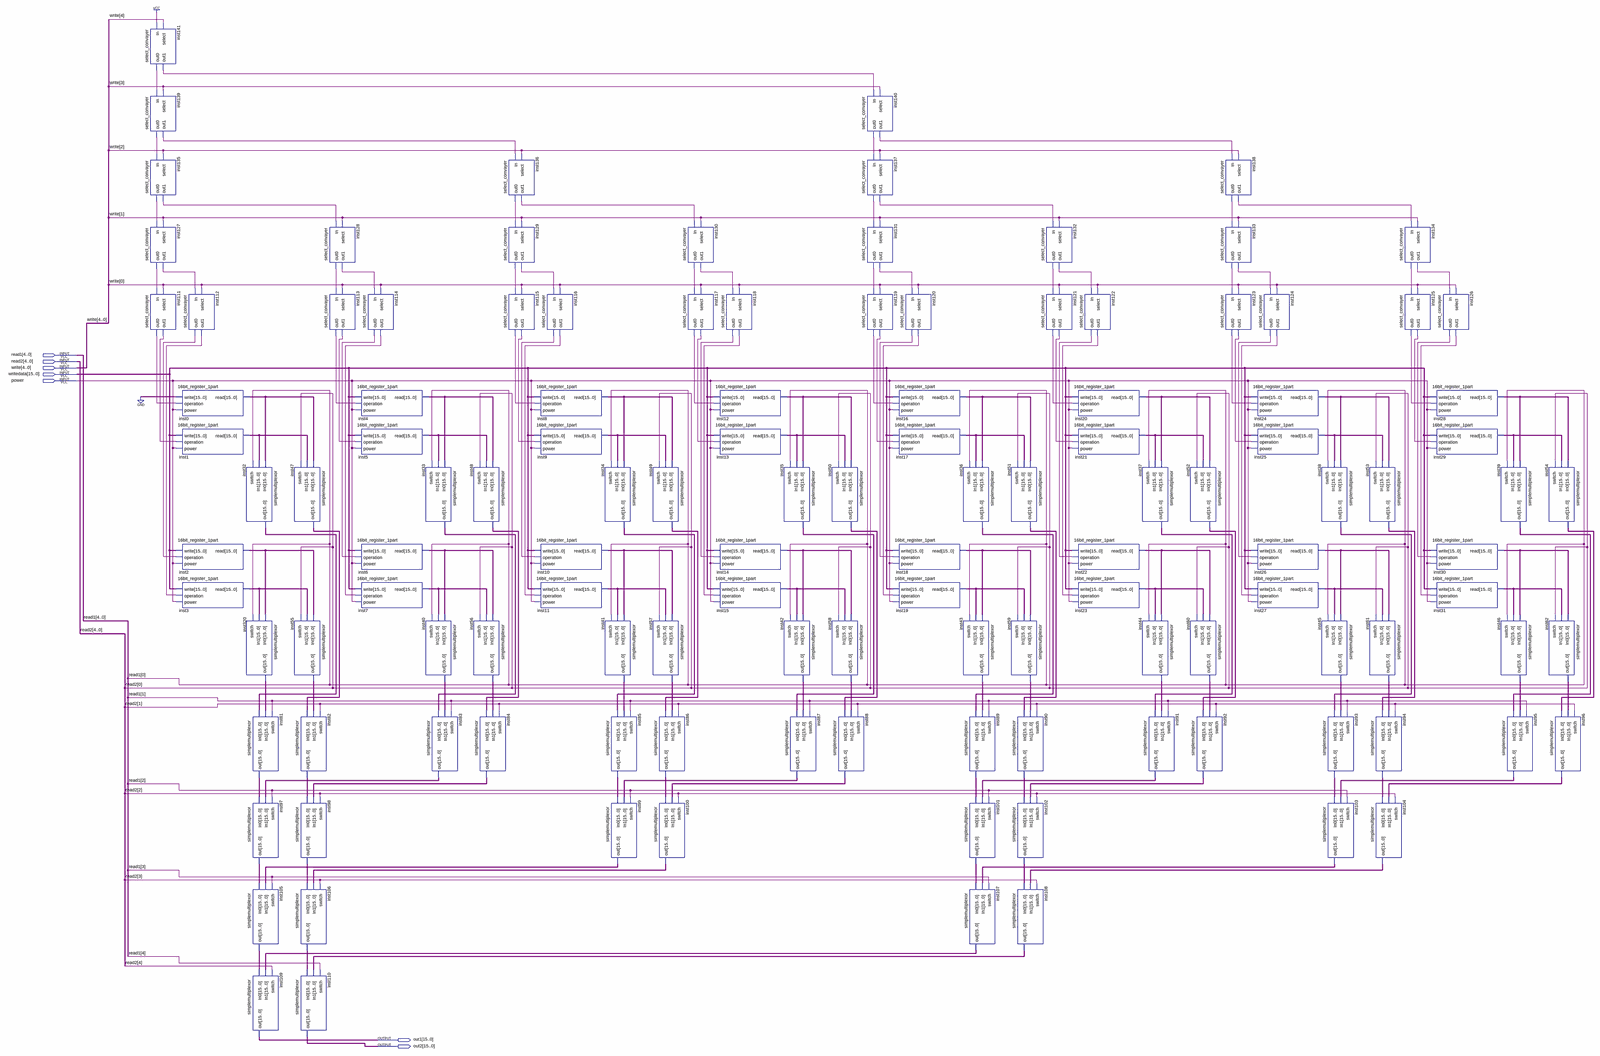
[diagram p0: schematic sheet, whole]
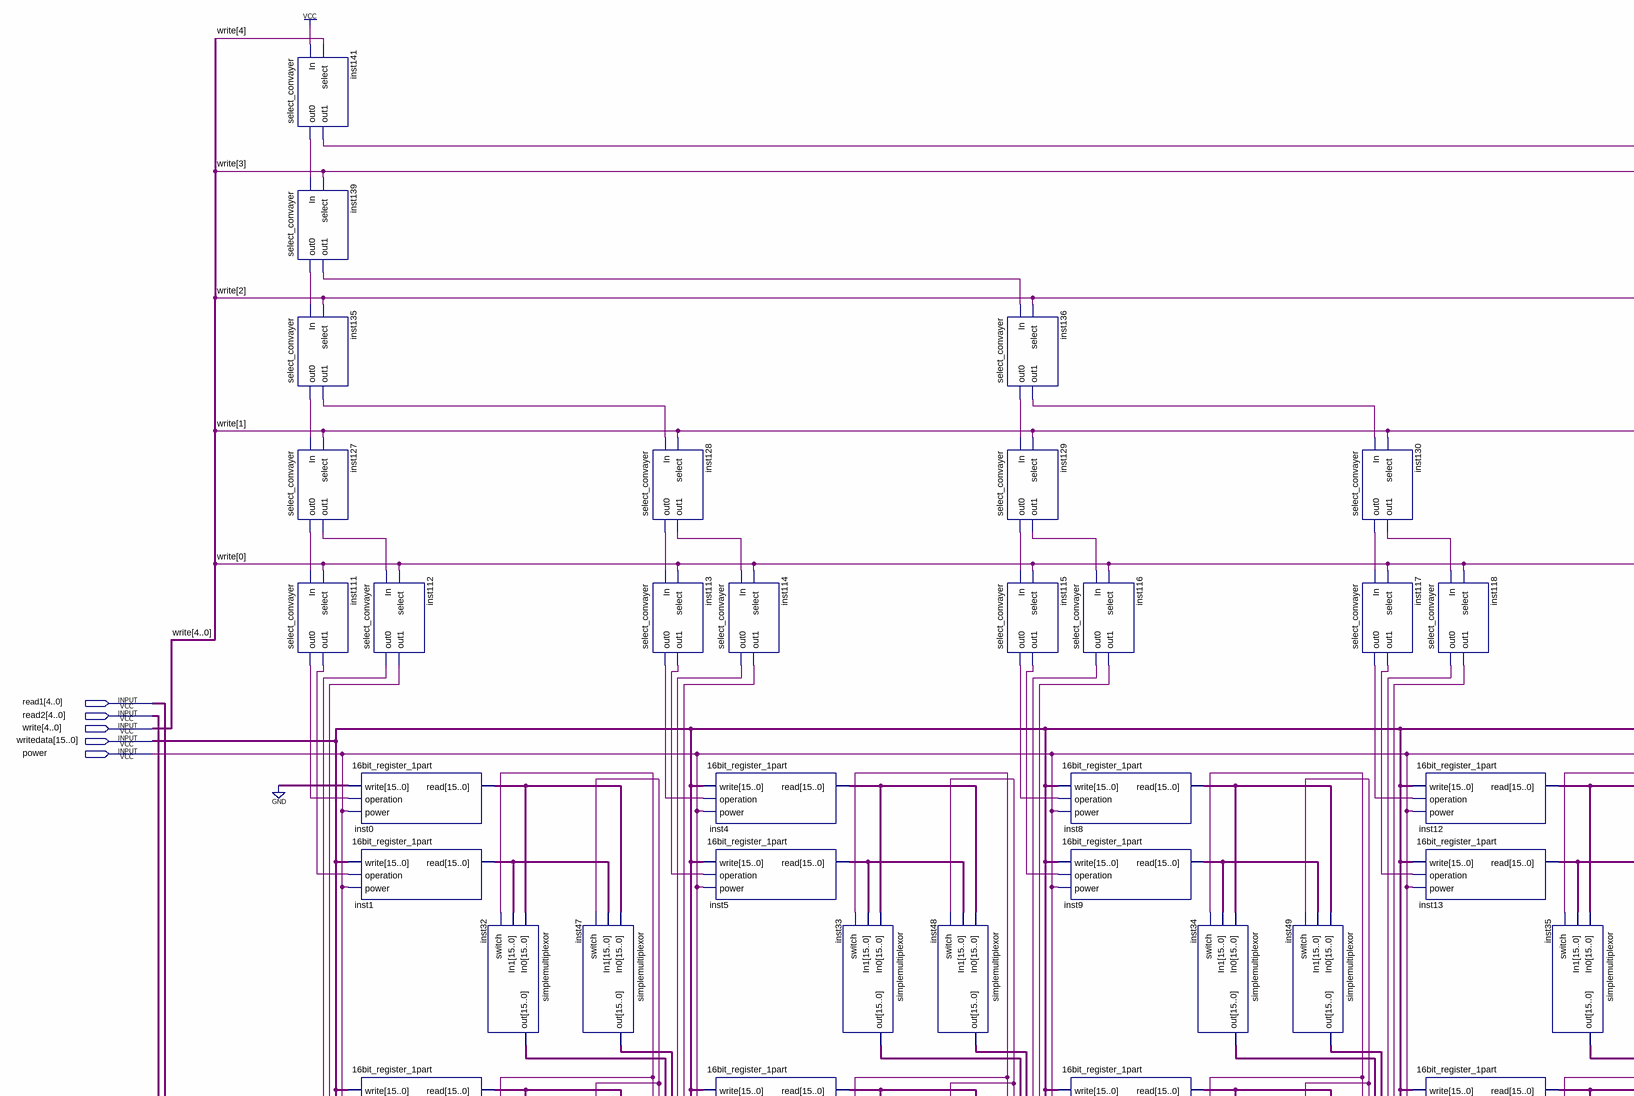
[diagram p1: schematic sheet, upper left part]
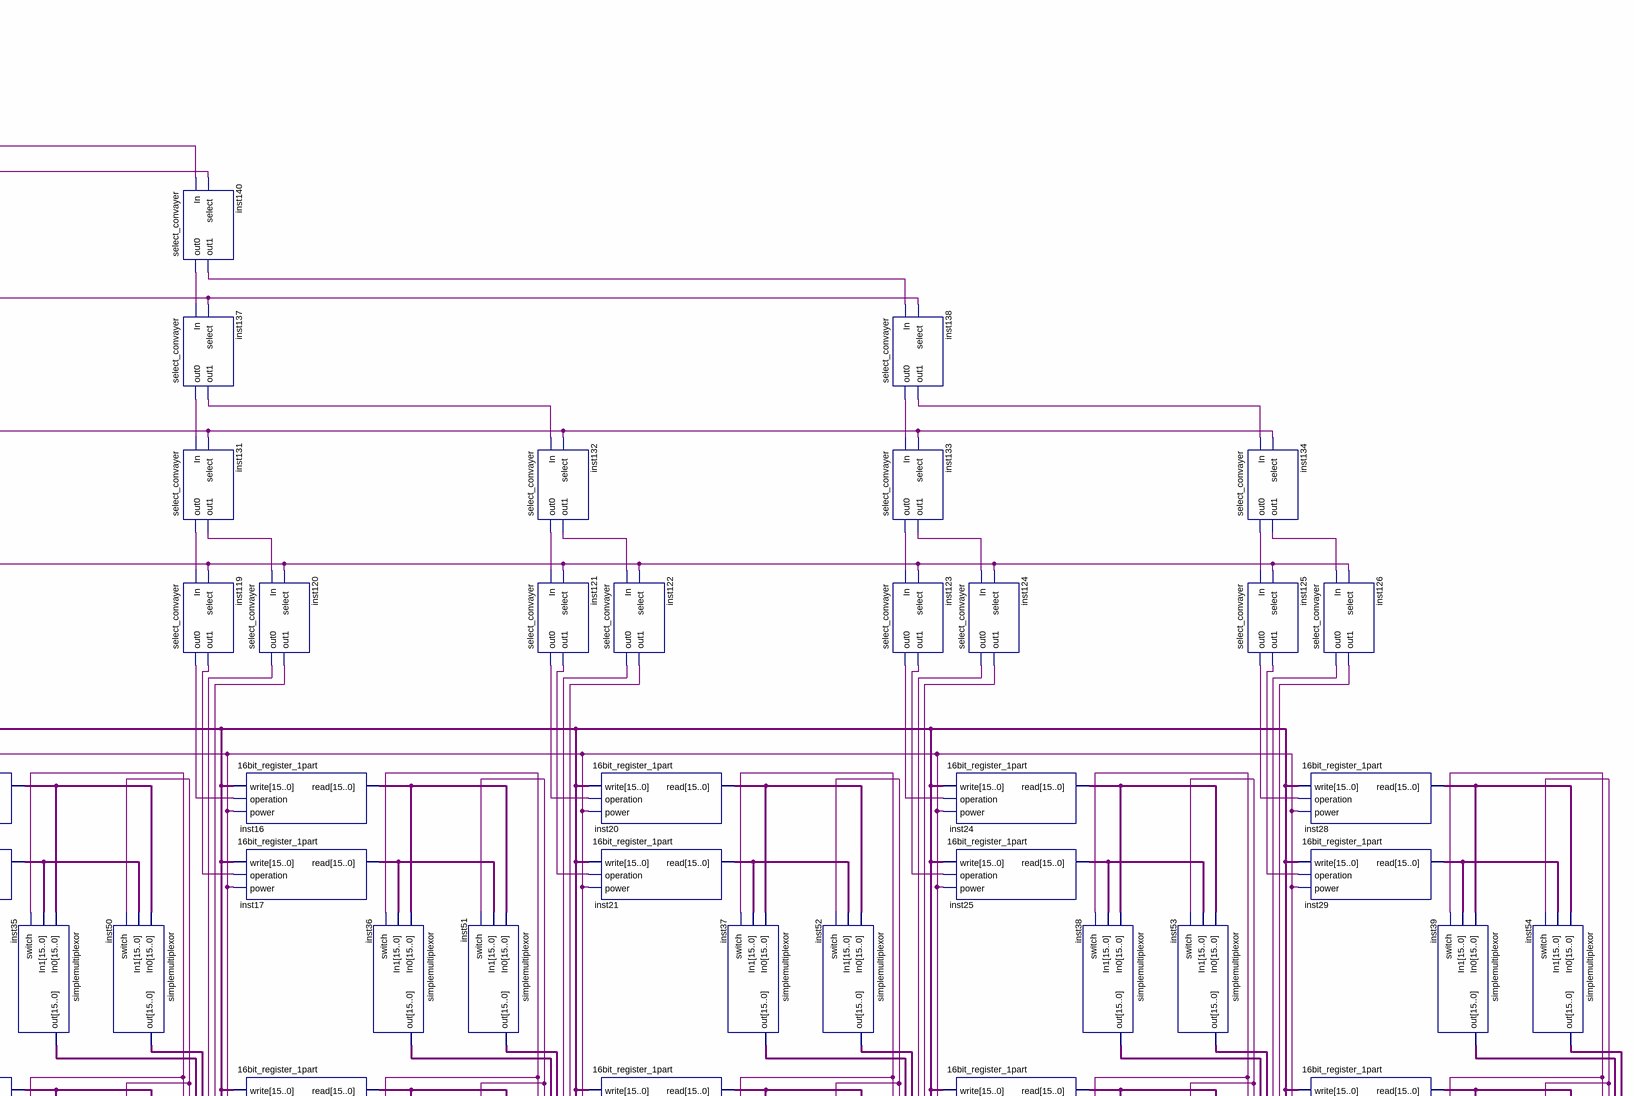
[diagram p2: schematic sheet, upper right part]
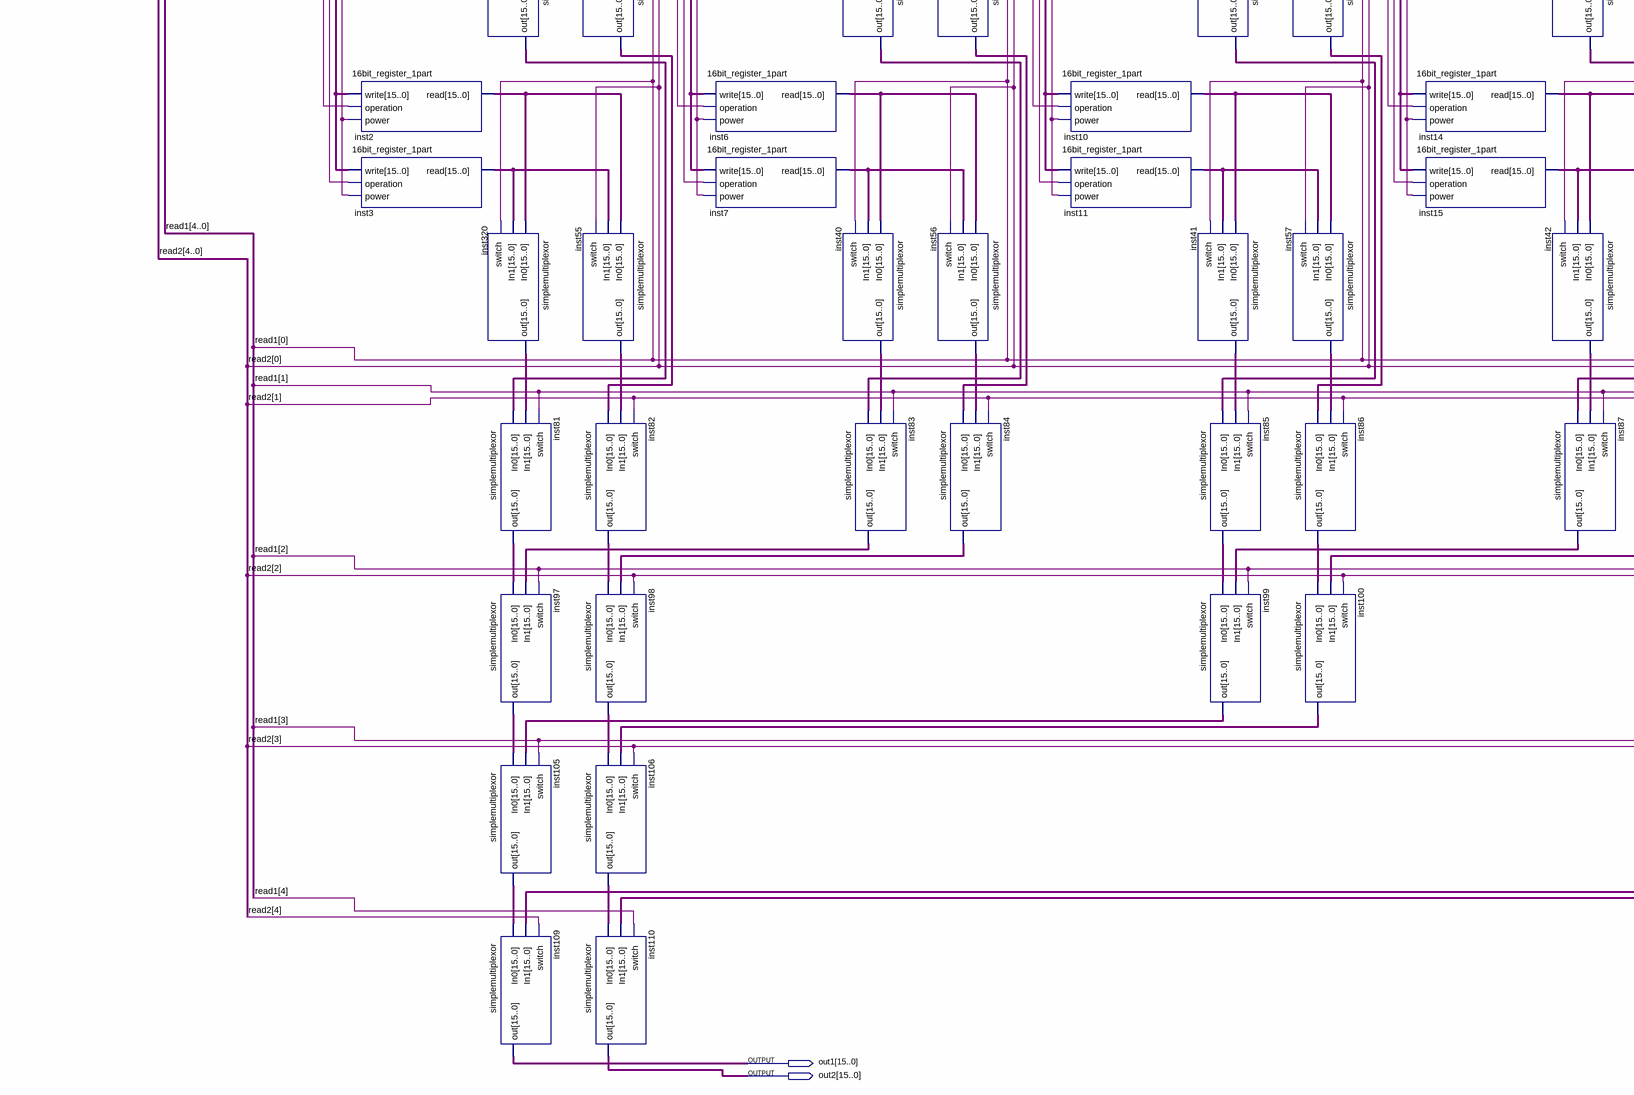
[diagram p3: schematic sheet, lower left part]
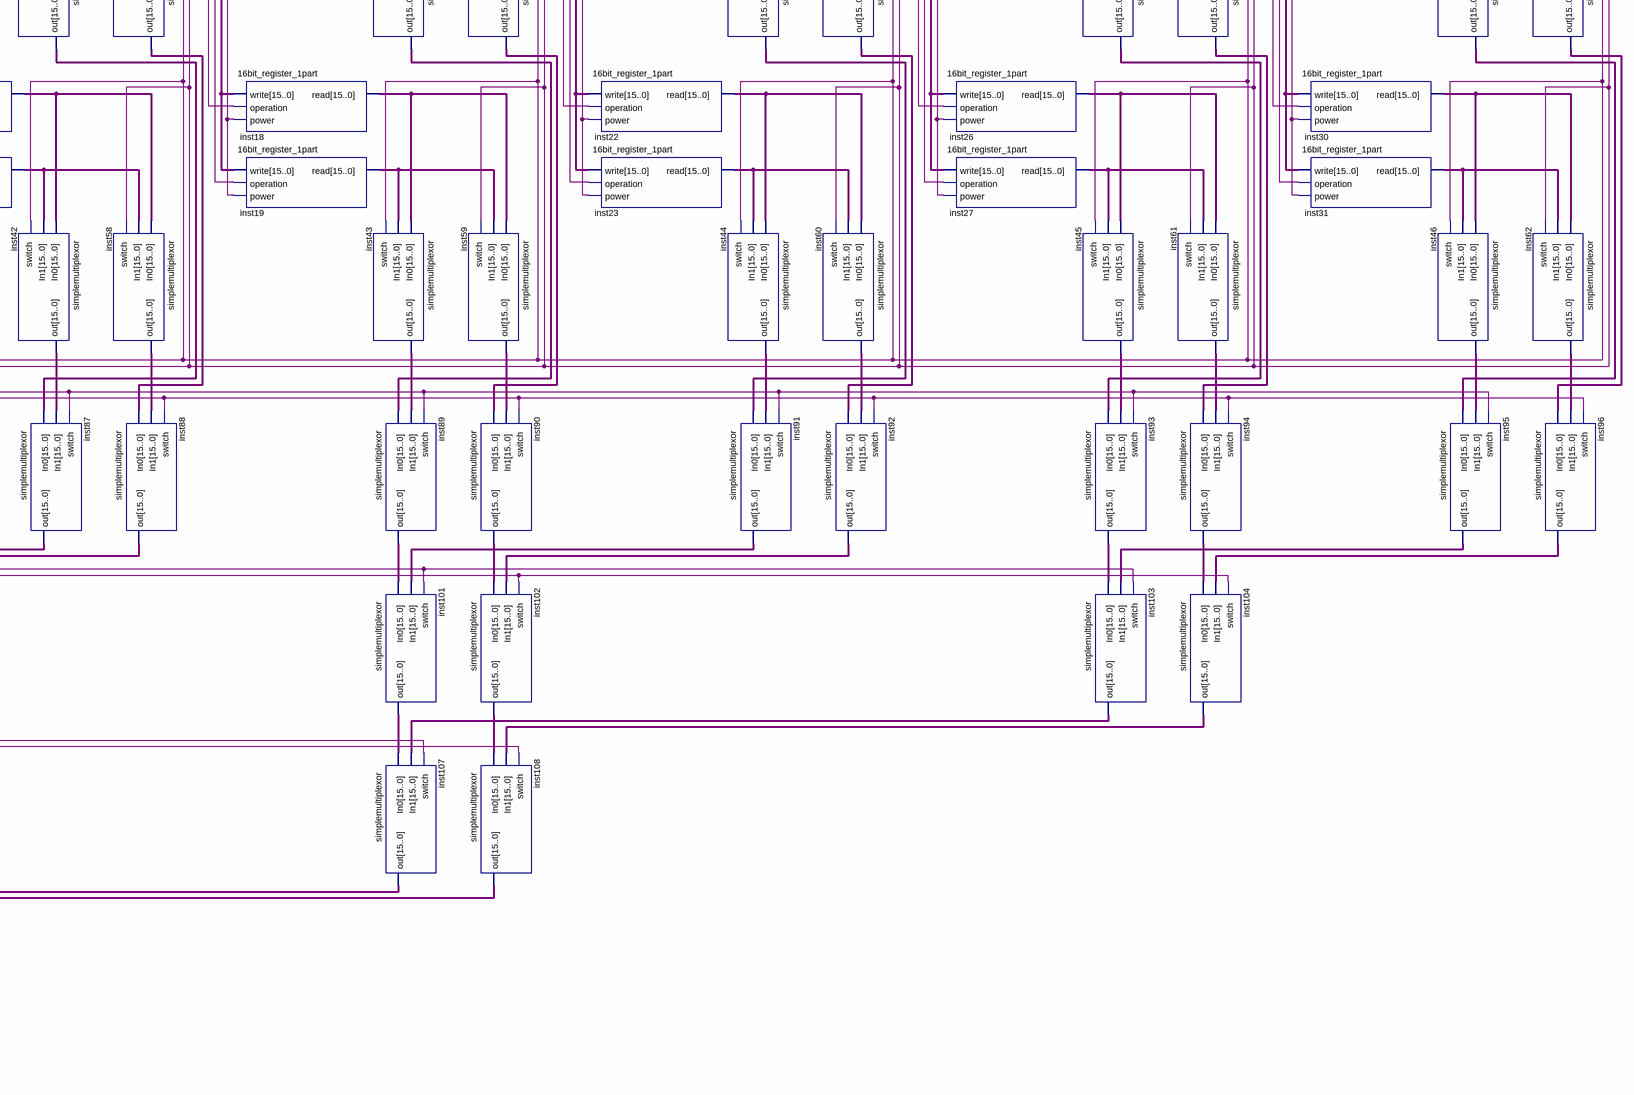
[diagram p4: schematic sheet, lower right part]
// Quartus schematic register.bdf as structural Verilog: 125 symbols, 7 pins
module register (
  input  [4:0] read1,
  input  [4:0] read2,
  input  [4:0] write,
  input  [15:0] writedata,
  input  power,
  output [15:0] out1,
  output [15:0] out2
);

  wire inst111_out0, inst111_out1, inst112_out0, inst112_out1, inst113_out0, inst113_out1, inst114_out0,
       inst114_out1, inst115_out0, inst115_out1, inst116_out0, inst116_out1, inst117_out0, inst117_out1,
       inst118_out0, inst118_out1, inst119_out0, inst119_out1, inst120_out0, inst120_out1, inst121_out0,
       inst121_out1, inst122_out0, inst122_out1, inst123_out0, inst123_out1, inst124_out0, inst124_out1,
       inst125_out0, inst125_out1, inst126_out0, inst126_out1, inst127_out0, inst127_out1, inst128_out0,
       inst128_out1, inst129_out0, inst129_out1, inst130_out0, inst130_out1, inst131_out0, inst131_out1,
       inst132_out0, inst132_out1, inst133_out0, inst133_out1, inst134_out0, inst134_out1, inst135_out0,
       inst135_out1, inst136_out0, inst136_out1, inst137_out0, inst137_out1, inst138_out0, inst138_out1,
       inst139_out0, inst139_out1, inst140_out0, inst140_out1, inst141_out0, inst141_out1;
  wire [15:0] inst0_read, inst1_read, inst2_read, inst3_read, inst4_read, inst5_read, inst6_read, inst7_read,
       inst8_read, inst9_read, inst10_read, inst11_read, inst12_read, inst13_read, inst14_read, inst15_read,
       inst16_read, inst17_read, inst18_read, inst19_read, inst20_read, inst21_read, inst22_read,
       inst23_read, inst24_read, inst25_read, inst26_read, inst27_read, inst28_read, inst29_read,
       inst30_read, inst31_read, inst32_out, inst33_out, inst34_out, inst35_out, inst36_out, inst37_out,
       inst38_out, inst39_out, inst40_out, inst41_out, inst42_out, inst43_out, inst44_out, inst45_out,
       inst46_out, inst47_out, inst48_out, inst49_out, inst50_out, inst51_out, inst52_out, inst53_out,
       inst54_out, inst55_out, inst56_out, inst57_out, inst58_out, inst59_out, inst60_out, inst61_out,
       inst62_out, inst81_out, inst82_out, inst83_out, inst84_out, inst85_out, inst86_out, inst87_out,
       inst88_out, inst89_out, inst90_out, inst91_out, inst92_out, inst93_out, inst94_out, inst95_out,
       inst96_out, inst97_out, inst98_out, inst99_out, inst100_out, inst101_out, inst102_out, inst103_out,
       inst104_out, inst105_out, inst106_out, inst107_out, inst108_out, inst320_out;

  select_convayer inst141 (.In(1'b1), .select(write[4]), .out0(inst141_out0), .out1(inst141_out1));
  select_convayer inst139 (.In(inst141_out0), .select(write[3]), .out0(inst139_out0), .out1(inst139_out1));
  select_convayer inst135 (.In(inst139_out0), .select(write[2]), .out0(inst135_out0), .out1(inst135_out1));
  select_convayer inst127 (.In(inst135_out0), .select(write[1]), .out0(inst127_out0), .out1(inst127_out1));
  select_convayer inst111 (.In(inst127_out0), .select(write[0]), .out0(inst111_out0), .out1(inst111_out1));
  \16bit_register_1part  inst0 (.write({16{1'b0}}), .operation(inst111_out0), .power(power), .read(inst0_read));
  \16bit_register_1part  inst1 (.write(writedata), .operation(inst111_out1), .power(power), .read(inst1_read));
  \16bit_register_1part  inst2 (.write(writedata), .operation(inst112_out0), .power(power), .read(inst2_read));
  \16bit_register_1part  inst3 (.write(writedata), .operation(inst112_out1), .power(power), .read(inst3_read));
  select_convayer inst112 (.In(inst127_out1), .select(write[0]), .out0(inst112_out0), .out1(inst112_out1));
  simplemultiplexor inst32 (.In0(inst0_read), .In1(inst1_read), .switch(read1[0]), .out(inst32_out));
  simplemultiplexor inst320 (.In0(inst2_read), .In1(inst3_read), .switch(read1[0]), .out(inst320_out));
  simplemultiplexor inst81 (.In0(inst32_out), .In1(inst320_out), .switch(read1[1]), .out(inst81_out));
  simplemultiplexor inst97 (.In0(inst81_out), .In1(inst83_out), .switch(read1[2]), .out(inst97_out));
  simplemultiplexor inst105 (.In0(inst97_out), .In1(inst99_out), .switch(read1[3]), .out(inst105_out));
  simplemultiplexor inst109 (.In0(inst105_out), .In1(inst107_out), .switch(read2[4]), .out(out1));
  simplemultiplexor inst47 (.In0(inst0_read), .In1(inst1_read), .switch(read2[0]), .out(inst47_out));
  simplemultiplexor inst55 (.In0(inst2_read), .In1(inst3_read), .switch(read2[0]), .out(inst55_out));
  simplemultiplexor inst82 (.In0(inst47_out), .In1(inst55_out), .switch(read2[1]), .out(inst82_out));
  simplemultiplexor inst98 (.In0(inst82_out), .In1(inst84_out), .switch(read2[2]), .out(inst98_out));
  simplemultiplexor inst106 (.In0(inst98_out), .In1(inst100_out), .switch(read2[3]), .out(inst106_out));
  simplemultiplexor inst110 (.In0(inst106_out), .In1(inst108_out), .switch(read1[4]), .out(out2));
  select_convayer inst128 (.In(inst135_out1), .select(write[1]), .out0(inst128_out0), .out1(inst128_out1));
  select_convayer inst113 (.In(inst128_out0), .select(write[0]), .out0(inst113_out0), .out1(inst113_out1));
  \16bit_register_1part  inst4 (.write(writedata), .operation(inst113_out0), .power(power), .read(inst4_read));
  \16bit_register_1part  inst5 (.write(writedata), .operation(inst113_out1), .power(power), .read(inst5_read));
  \16bit_register_1part  inst6 (.write(writedata), .operation(inst114_out0), .power(power), .read(inst6_read));
  \16bit_register_1part  inst7 (.write(writedata), .operation(inst114_out1), .power(power), .read(inst7_read));
  select_convayer inst114 (.In(inst128_out1), .select(write[0]), .out0(inst114_out0), .out1(inst114_out1));
  simplemultiplexor inst33 (.In0(inst4_read), .In1(inst5_read), .switch(read1[0]), .out(inst33_out));
  simplemultiplexor inst40 (.In0(inst6_read), .In1(inst7_read), .switch(read1[0]), .out(inst40_out));
  simplemultiplexor inst83 (.In0(inst33_out), .In1(inst40_out), .switch(read1[1]), .out(inst83_out));
  simplemultiplexor inst48 (.In0(inst4_read), .In1(inst5_read), .switch(read2[0]), .out(inst48_out));
  simplemultiplexor inst56 (.In0(inst6_read), .In1(inst7_read), .switch(read2[0]), .out(inst56_out));
  simplemultiplexor inst84 (.In0(inst48_out), .In1(inst56_out), .switch(read2[1]), .out(inst84_out));
  select_convayer inst136 (.In(inst139_out1), .select(write[2]), .out0(inst136_out0), .out1(inst136_out1));
  select_convayer inst129 (.In(inst136_out0), .select(write[1]), .out0(inst129_out0), .out1(inst129_out1));
  select_convayer inst115 (.In(inst129_out0), .select(write[0]), .out0(inst115_out0), .out1(inst115_out1));
  \16bit_register_1part  inst8 (.write(writedata), .operation(inst115_out0), .power(power), .read(inst8_read));
  \16bit_register_1part  inst9 (.write(writedata), .operation(inst115_out1), .power(power), .read(inst9_read));
  \16bit_register_1part  inst10 (.write(writedata), .operation(inst116_out0), .power(power), .read(inst10_read));
  \16bit_register_1part  inst11 (.write(writedata), .operation(inst116_out1), .power(power), .read(inst11_read));
  select_convayer inst116 (.In(inst129_out1), .select(write[0]), .out0(inst116_out0), .out1(inst116_out1));
  simplemultiplexor inst34 (.In0(inst8_read), .In1(inst9_read), .switch(read1[0]), .out(inst34_out));
  simplemultiplexor inst41 (.In0(inst10_read), .In1(inst11_read), .switch(read1[0]), .out(inst41_out));
  simplemultiplexor inst85 (.In0(inst34_out), .In1(inst41_out), .switch(read1[1]), .out(inst85_out));
  simplemultiplexor inst99 (.In0(inst85_out), .In1(inst87_out), .switch(read1[2]), .out(inst99_out));
  simplemultiplexor inst49 (.In0(inst8_read), .In1(inst9_read), .switch(read2[0]), .out(inst49_out));
  simplemultiplexor inst57 (.In0(inst10_read), .In1(inst11_read), .switch(read2[0]), .out(inst57_out));
  simplemultiplexor inst86 (.In0(inst49_out), .In1(inst57_out), .switch(read2[1]), .out(inst86_out));
  simplemultiplexor inst100 (.In0(inst86_out), .In1(inst88_out), .switch(read2[2]), .out(inst100_out));
  select_convayer inst130 (.In(inst136_out1), .select(write[1]), .out0(inst130_out0), .out1(inst130_out1));
  select_convayer inst117 (.In(inst130_out0), .select(write[0]), .out0(inst117_out0), .out1(inst117_out1));
  \16bit_register_1part  inst12 (.write(writedata), .operation(inst117_out0), .power(power), .read(inst12_read));
  \16bit_register_1part  inst13 (.write(writedata), .operation(inst117_out1), .power(power), .read(inst13_read));
  \16bit_register_1part  inst14 (.write(writedata), .operation(inst118_out0), .power(power), .read(inst14_read));
  \16bit_register_1part  inst15 (.write(writedata), .operation(inst118_out1), .power(power), .read(inst15_read));
  select_convayer inst118 (.In(inst130_out1), .select(write[0]), .out0(inst118_out0), .out1(inst118_out1));
  simplemultiplexor inst35 (.In0(inst12_read), .In1(inst13_read), .switch(read1[0]), .out(inst35_out));
  simplemultiplexor inst42 (.In0(inst14_read), .In1(inst15_read), .switch(read1[0]), .out(inst42_out));
  simplemultiplexor inst87 (.In0(inst35_out), .In1(inst42_out), .switch(read1[1]), .out(inst87_out));
  simplemultiplexor inst50 (.In0(inst12_read), .In1(inst13_read), .switch(read2[0]), .out(inst50_out));
  simplemultiplexor inst58 (.In0(inst14_read), .In1(inst15_read), .switch(read2[0]), .out(inst58_out));
  simplemultiplexor inst88 (.In0(inst50_out), .In1(inst58_out), .switch(read2[1]), .out(inst88_out));
  select_convayer inst140 (.In(inst141_out1), .select(write[3]), .out0(inst140_out0), .out1(inst140_out1));
  select_convayer inst137 (.In(inst140_out0), .select(write[2]), .out0(inst137_out0), .out1(inst137_out1));
  select_convayer inst131 (.In(inst137_out0), .select(write[1]), .out0(inst131_out0), .out1(inst131_out1));
  select_convayer inst119 (.In(inst131_out0), .select(write[0]), .out0(inst119_out0), .out1(inst119_out1));
  \16bit_register_1part  inst16 (.write(writedata), .operation(inst119_out0), .power(power), .read(inst16_read));
  \16bit_register_1part  inst17 (.write(writedata), .operation(inst119_out1), .power(power), .read(inst17_read));
  \16bit_register_1part  inst18 (.write(writedata), .operation(inst120_out0), .power(power), .read(inst18_read));
  \16bit_register_1part  inst19 (.write(writedata), .operation(inst120_out1), .power(power), .read(inst19_read));
  select_convayer inst120 (.In(inst131_out1), .select(write[0]), .out0(inst120_out0), .out1(inst120_out1));
  simplemultiplexor inst36 (.In0(inst16_read), .In1(inst17_read), .switch(read1[0]), .out(inst36_out));
  simplemultiplexor inst43 (.In0(inst18_read), .In1(inst19_read), .switch(read1[0]), .out(inst43_out));
  simplemultiplexor inst89 (.In0(inst36_out), .In1(inst43_out), .switch(read1[1]), .out(inst89_out));
  simplemultiplexor inst101 (.In0(inst89_out), .In1(inst91_out), .switch(read1[2]), .out(inst101_out));
  simplemultiplexor inst107 (.In0(inst101_out), .In1(inst103_out), .switch(read1[3]), .out(inst107_out));
  simplemultiplexor inst51 (.In0(inst16_read), .In1(inst17_read), .switch(read2[0]), .out(inst51_out));
  simplemultiplexor inst59 (.In0(inst18_read), .In1(inst19_read), .switch(read2[0]), .out(inst59_out));
  simplemultiplexor inst90 (.In0(inst51_out), .In1(inst59_out), .switch(read2[1]), .out(inst90_out));
  simplemultiplexor inst102 (.In0(inst90_out), .In1(inst92_out), .switch(read2[2]), .out(inst102_out));
  simplemultiplexor inst108 (.In0(inst102_out), .In1(inst104_out), .switch(read2[3]), .out(inst108_out));
  select_convayer inst132 (.In(inst137_out1), .select(write[1]), .out0(inst132_out0), .out1(inst132_out1));
  select_convayer inst121 (.In(inst132_out0), .select(write[0]), .out0(inst121_out0), .out1(inst121_out1));
  \16bit_register_1part  inst20 (.write(writedata), .operation(inst121_out0), .power(power), .read(inst20_read));
  \16bit_register_1part  inst21 (.write(writedata), .operation(inst121_out1), .power(power), .read(inst21_read));
  \16bit_register_1part  inst22 (.write(writedata), .operation(inst122_out0), .power(power), .read(inst22_read));
  \16bit_register_1part  inst23 (.write(writedata), .operation(inst122_out1), .power(power), .read(inst23_read));
  select_convayer inst122 (.In(inst132_out1), .select(write[0]), .out0(inst122_out0), .out1(inst122_out1));
  simplemultiplexor inst37 (.In0(inst20_read), .In1(inst21_read), .switch(read1[0]), .out(inst37_out));
  simplemultiplexor inst44 (.In0(inst22_read), .In1(inst23_read), .switch(read1[0]), .out(inst44_out));
  simplemultiplexor inst91 (.In0(inst37_out), .In1(inst44_out), .switch(read1[1]), .out(inst91_out));
  simplemultiplexor inst52 (.In0(inst20_read), .In1(inst21_read), .switch(read2[0]), .out(inst52_out));
  simplemultiplexor inst60 (.In0(inst22_read), .In1(inst23_read), .switch(read2[0]), .out(inst60_out));
  simplemultiplexor inst92 (.In0(inst52_out), .In1(inst60_out), .switch(read2[1]), .out(inst92_out));
  select_convayer inst138 (.In(inst140_out1), .select(write[2]), .out0(inst138_out0), .out1(inst138_out1));
  select_convayer inst133 (.In(inst138_out0), .select(write[1]), .out0(inst133_out0), .out1(inst133_out1));
  select_convayer inst123 (.In(inst133_out0), .select(write[0]), .out0(inst123_out0), .out1(inst123_out1));
  \16bit_register_1part  inst24 (.write(writedata), .operation(inst123_out0), .power(power), .read(inst24_read));
  \16bit_register_1part  inst25 (.write(writedata), .operation(inst123_out1), .power(power), .read(inst25_read));
  \16bit_register_1part  inst26 (.write(writedata), .operation(inst124_out0), .power(power), .read(inst26_read));
  \16bit_register_1part  inst27 (.write(writedata), .operation(inst124_out1), .power(power), .read(inst27_read));
  select_convayer inst124 (.In(inst133_out1), .select(write[0]), .out0(inst124_out0), .out1(inst124_out1));
  simplemultiplexor inst38 (.In0(inst24_read), .In1(inst25_read), .switch(read1[0]), .out(inst38_out));
  simplemultiplexor inst45 (.In0(inst26_read), .In1(inst27_read), .switch(read1[0]), .out(inst45_out));
  simplemultiplexor inst93 (.In0(inst38_out), .In1(inst45_out), .switch(read1[1]), .out(inst93_out));
  simplemultiplexor inst103 (.In0(inst93_out), .In1(inst95_out), .switch(read1[2]), .out(inst103_out));
  simplemultiplexor inst53 (.In0(inst24_read), .In1(inst25_read), .switch(read2[0]), .out(inst53_out));
  simplemultiplexor inst61 (.In0(inst26_read), .In1(inst27_read), .switch(read2[0]), .out(inst61_out));
  simplemultiplexor inst94 (.In0(inst53_out), .In1(inst61_out), .switch(read2[1]), .out(inst94_out));
  simplemultiplexor inst104 (.In0(inst94_out), .In1(inst96_out), .switch(read2[2]), .out(inst104_out));
  select_convayer inst134 (.In(inst138_out1), .select(write[1]), .out0(inst134_out0), .out1(inst134_out1));
  select_convayer inst125 (.In(inst134_out0), .select(write[0]), .out0(inst125_out0), .out1(inst125_out1));
  \16bit_register_1part  inst28 (.write(writedata), .operation(inst125_out0), .power(power), .read(inst28_read));
  \16bit_register_1part  inst29 (.write(writedata), .operation(inst125_out1), .power(power), .read(inst29_read));
  \16bit_register_1part  inst30 (.write(writedata), .operation(inst126_out0), .power(power), .read(inst30_read));
  \16bit_register_1part  inst31 (.write(writedata), .operation(inst126_out1), .power(power), .read(inst31_read));
  select_convayer inst126 (.In(inst134_out1), .select(write[0]), .out0(inst126_out0), .out1(inst126_out1));
  simplemultiplexor inst39 (.In0(inst28_read), .In1(inst29_read), .switch(read1[0]), .out(inst39_out));
  simplemultiplexor inst46 (.In0(inst30_read), .In1(inst31_read), .switch(read1[0]), .out(inst46_out));
  simplemultiplexor inst95 (.In0(inst39_out), .In1(inst46_out), .switch(read1[1]), .out(inst95_out));
  simplemultiplexor inst54 (.In0(inst28_read), .In1(inst29_read), .switch(read2[0]), .out(inst54_out));
  simplemultiplexor inst62 (.In0(inst30_read), .In1(inst31_read), .switch(read2[0]), .out(inst62_out));
  simplemultiplexor inst96 (.In0(inst54_out), .In1(inst62_out), .switch(read2[1]), .out(inst96_out));
endmodule
